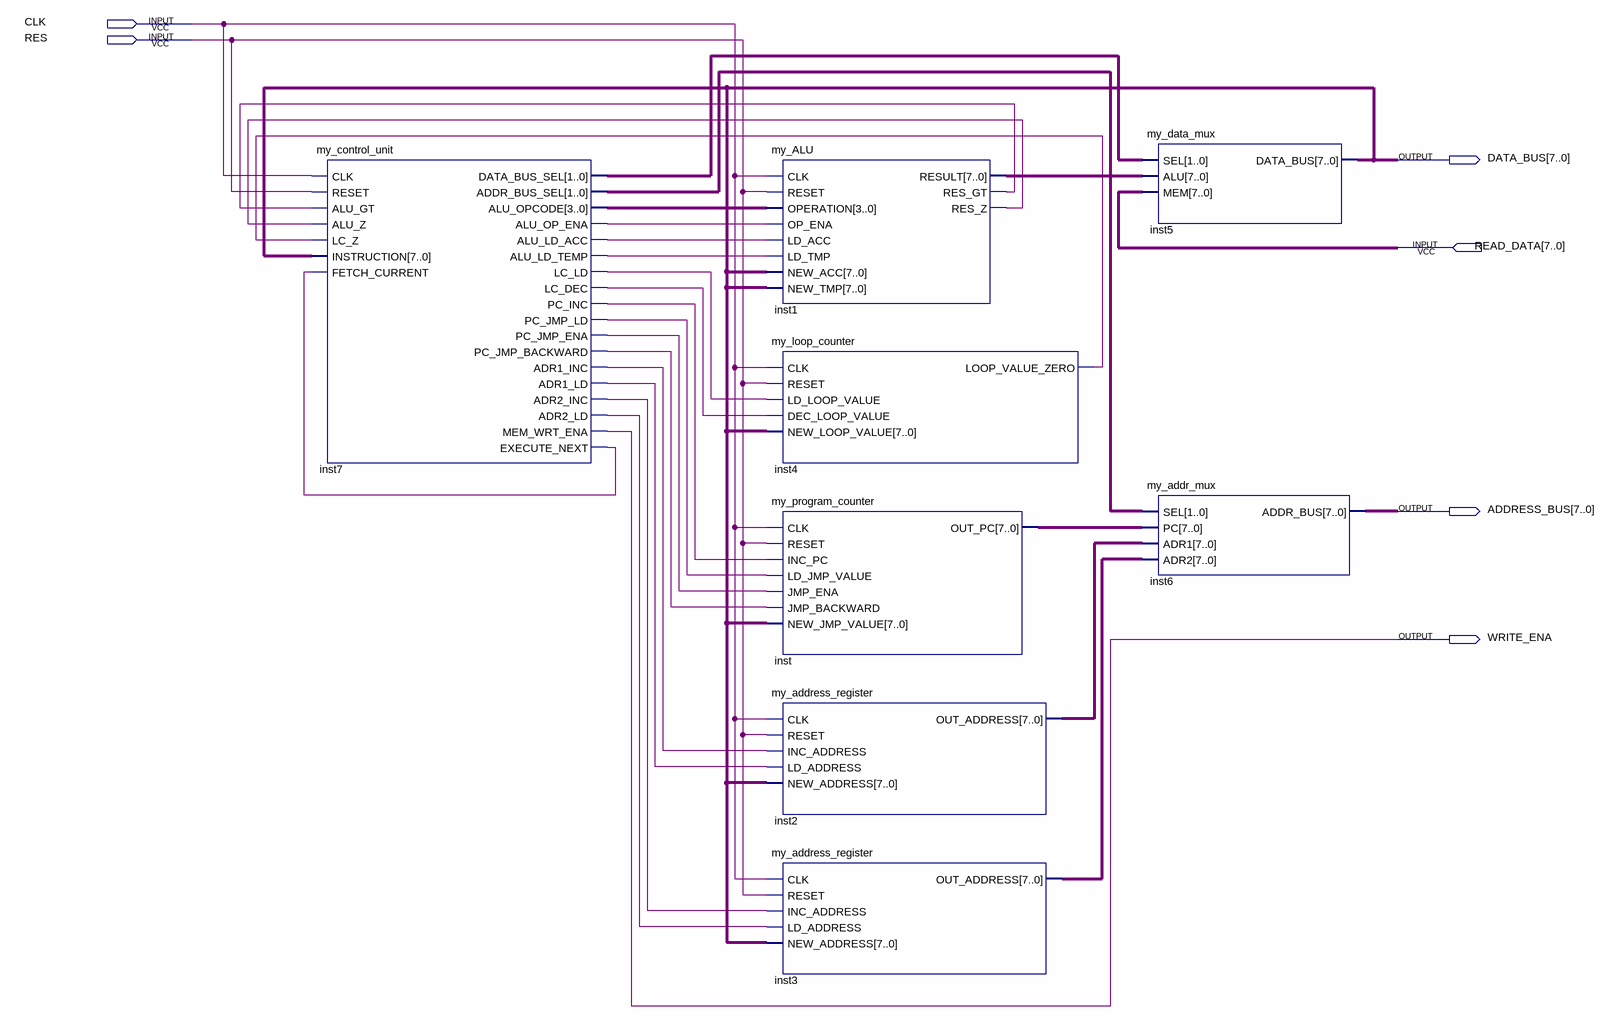
[diagram p0: schematic sheet]
// Quartus schematic my_CPU.bdf as structural Verilog: 8 symbols, 6 pins
module my_CPU (
  input  CLK,
  input  RES,
  input  [7:0] READ_DATA,
  output [7:0] DATA_BUS,
  output [7:0] ADDRESS_BUS,
  output WRITE_ENA
);

  wire inst1_res_gt, inst1_res_z, inst4_loop_value_zero, inst7_adr1_inc, inst7_adr1_ld, inst7_adr2_inc,
       inst7_adr2_ld, inst7_alu_ld_acc, inst7_alu_ld_temp, inst7_alu_op_ena, inst7_execute_next,
       inst7_lc_dec, inst7_lc_ld, inst7_pc_inc, inst7_pc_jmp_backward, inst7_pc_jmp_ena, inst7_pc_jmp_ld;
  wire [1:0] inst7_addr_bus_sel, inst7_data_bus_sel;
  wire [3:0] inst7_alu_opcode;
  wire [7:0] inst1_result, inst2_out_address, inst3_out_address, inst_out_pc;

  my_control_unit inst7 (
    .CLK(CLK), .RESET(RES), .ALU_GT(inst1_res_gt), .ALU_Z(inst1_res_z), .LC_Z(inst4_loop_value_zero),
    .INSTRUCTION(DATA_BUS), .FETCH_CURRENT(inst7_execute_next), .DATA_BUS_SEL(inst7_data_bus_sel),
    .ADDR_BUS_SEL(inst7_addr_bus_sel), .ALU_OPCODE(inst7_alu_opcode), .ALU_OP_ENA(inst7_alu_op_ena),
    .ALU_LD_ACC(inst7_alu_ld_acc), .ALU_LD_TEMP(inst7_alu_ld_temp), .LC_LD(inst7_lc_ld),
    .LC_DEC(inst7_lc_dec), .PC_INC(inst7_pc_inc), .PC_JMP_LD(inst7_pc_jmp_ld), .PC_JMP_ENA(inst7_pc_jmp_ena),
    .PC_JMP_BACKWARD(inst7_pc_jmp_backward), .ADR1_INC(inst7_adr1_inc), .ADR1_LD(inst7_adr1_ld),
    .ADR2_INC(inst7_adr2_inc), .ADR2_LD(inst7_adr2_ld), .MEM_WRT_ENA(WRITE_ENA),
    .EXECUTE_NEXT(inst7_execute_next));
  my_ALU inst1 (
    .CLK(CLK), .RESET(RES), .OPERATION(inst7_alu_opcode), .OP_ENA(inst7_alu_op_ena),
    .LD_ACC(inst7_alu_ld_acc), .LD_TMP(inst7_alu_ld_temp), .NEW_ACC(DATA_BUS), .NEW_TMP(DATA_BUS),
    .RESULT(inst1_result), .RES_GT(inst1_res_gt), .RES_Z(inst1_res_z));
  my_loop_counter inst4 (
    .CLK(CLK), .RESET(RES), .LD_LOOP_VALUE(inst7_lc_ld), .DEC_LOOP_VALUE(inst7_lc_dec),
    .NEW_LOOP_VALUE(DATA_BUS), .LOOP_VALUE_ZERO(inst4_loop_value_zero));
  my_program_counter inst (
    .CLK(CLK), .RESET(RES), .INC_PC(inst7_pc_inc), .LD_JMP_VALUE(inst7_pc_jmp_ld),
    .JMP_ENA(inst7_pc_jmp_ena), .JMP_BACKWARD(inst7_pc_jmp_backward), .NEW_JMP_VALUE(DATA_BUS),
    .OUT_PC(inst_out_pc));
  my_address_register inst2 (
    .CLK(CLK), .RESET(RES), .INC_ADDRESS(inst7_adr1_inc), .LD_ADDRESS(inst7_adr1_ld), .NEW_ADDRESS(DATA_BUS),
    .OUT_ADDRESS(inst2_out_address));
  my_address_register inst3 (
    .CLK(CLK), .RESET(RES), .INC_ADDRESS(inst7_adr2_inc), .LD_ADDRESS(inst7_adr2_ld), .NEW_ADDRESS(DATA_BUS),
    .OUT_ADDRESS(inst3_out_address));
  my_data_mux inst5 (.SEL(inst7_data_bus_sel), .ALU(inst1_result), .MEM(READ_DATA), .DATA_BUS(DATA_BUS));
  my_addr_mux inst6 (
    .SEL(inst7_addr_bus_sel), .PC(inst_out_pc), .ADR1(inst2_out_address), .ADR2(inst3_out_address),
    .ADDR_BUS(ADDRESS_BUS));
endmodule
